# EAGLE design distribution_board (EAGLE 6.4)
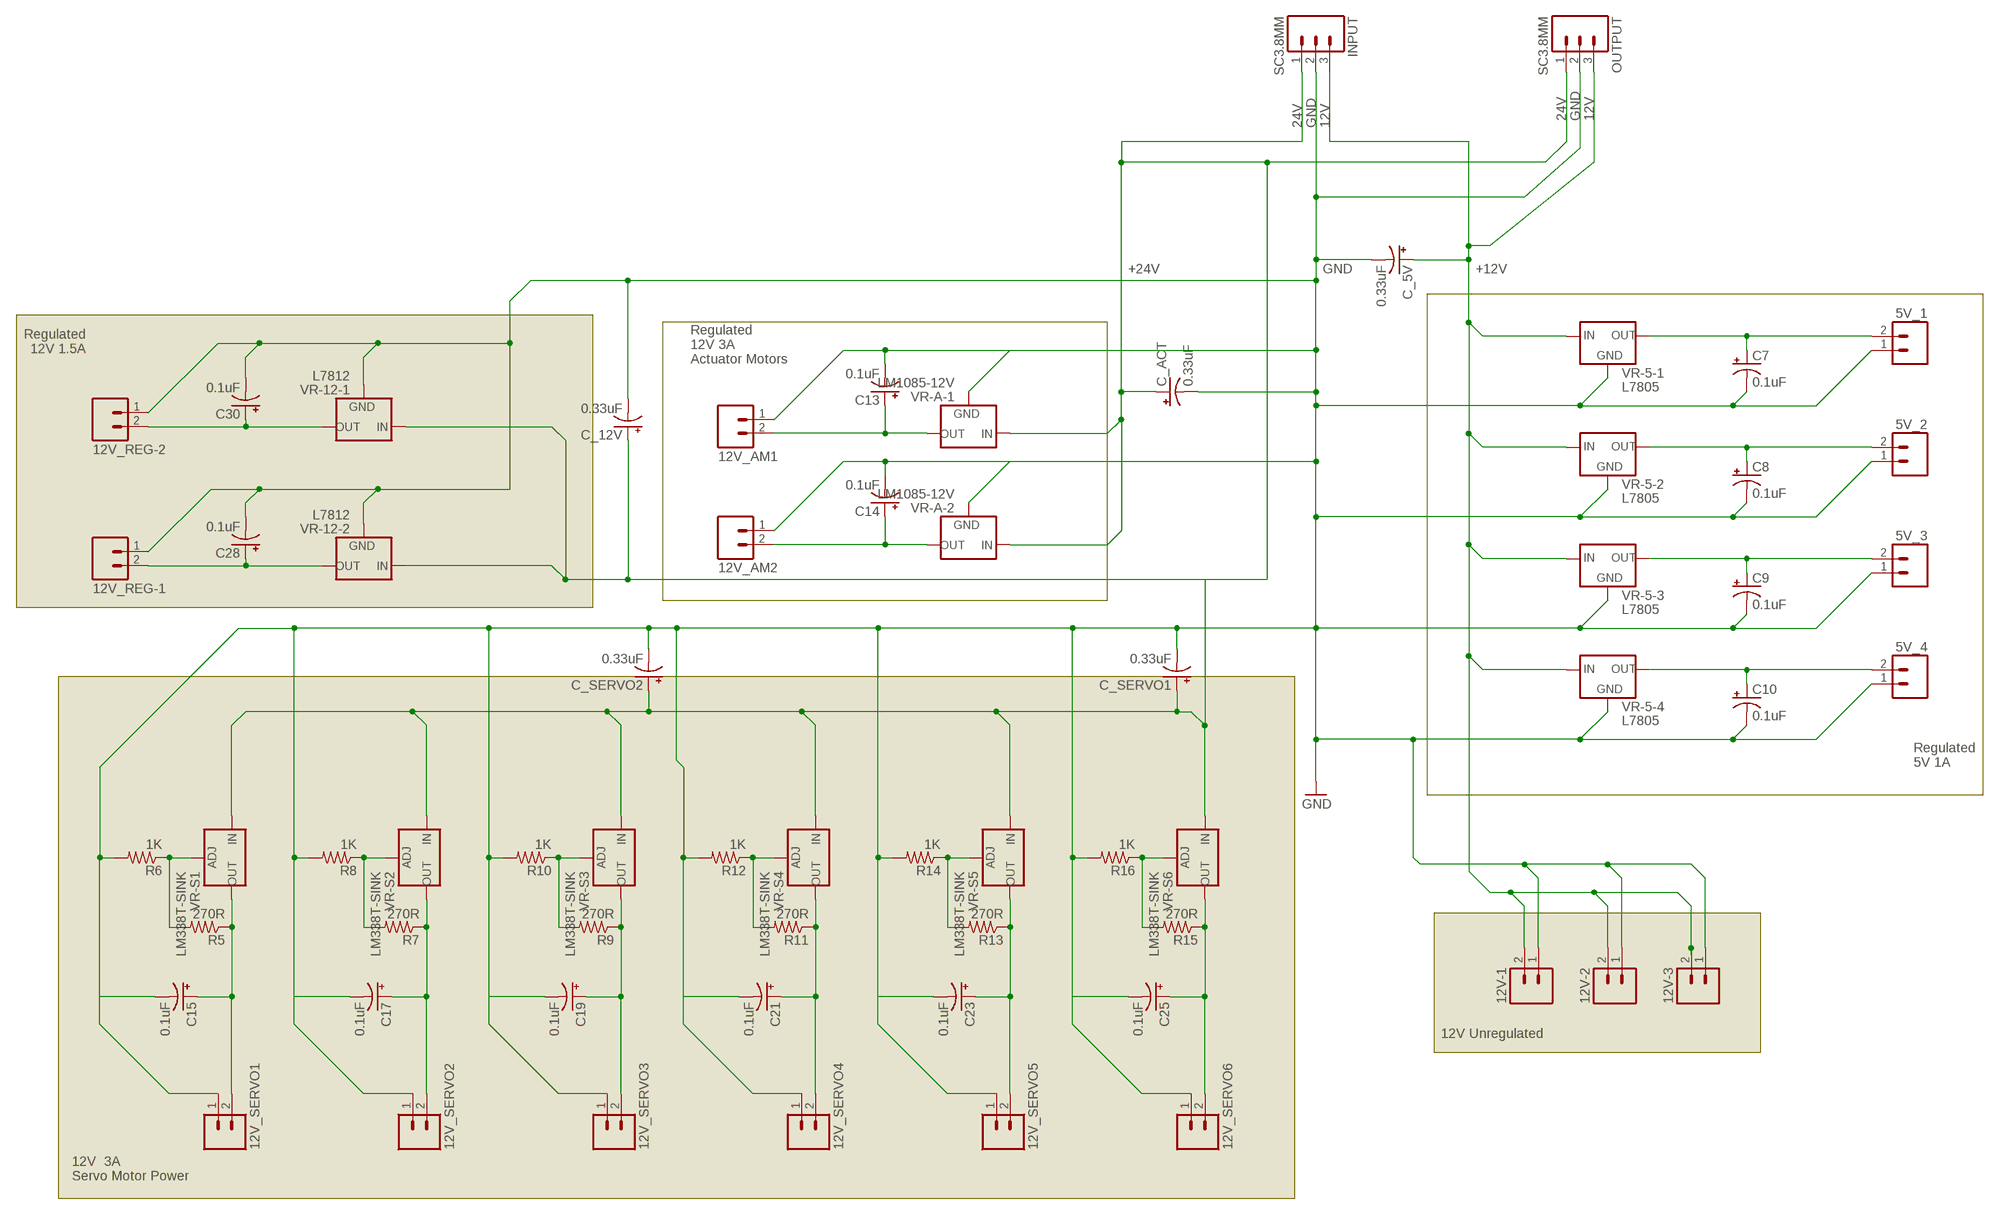
[diagram p0: schematic, sheet 1]

## Parts
5V_1  SC3.81MM  2-HOLESSC3.81MM  [SCREWTERMINAL-3.81MM]
5V_2  SC3.81MM  2-HOLESSC3.81MM  [SCREWTERMINAL-3.81MM]
5V_3  SC3.81MM  2-HOLESSC3.81MM  [SCREWTERMINAL-3.81MM]
5V_4  SC3.81MM  2-HOLESSC3.81MM  [SCREWTERMINAL-3.81MM]
12V-1  SC3.81MM  2-HOLESSC3.81MM  [SCREWTERMINAL-3.81MM]
12V-2  SC3.81MM  2-HOLESSC3.81MM  [SCREWTERMINAL-3.81MM]
12V-3  SC3.81MM  2-HOLESSC3.81MM  [SCREWTERMINAL-3.81MM]
12V_AM1  SC3.81MM  2-HOLESSC3.81MM  [SCREWTERMINAL-3.81MM]
12V_AM2  SC3.81MM  2-HOLESSC3.81MM  [SCREWTERMINAL-3.81MM]
12V_REG-1  SC3.81MM  2-HOLESSC3.81MM  [SCREWTERMINAL-3.81MM]
12V_REG-2  SC3.81MM  2-HOLESSC3.81MM  [SCREWTERMINAL-3.81MM]
12V_SERVO1  SC3.81MM  2-HOLESSC3.81MM  [SCREWTERMINAL-3.81MM]
12V_SERVO2  SC3.81MM  2-HOLESSC3.81MM  [SCREWTERMINAL-3.81MM]
12V_SERVO3  SC3.81MM  2-HOLESSC3.81MM  [SCREWTERMINAL-3.81MM]
12V_SERVO4  SC3.81MM  2-HOLESSC3.81MM  [SCREWTERMINAL-3.81MM]
12V_SERVO5  SC3.81MM  2-HOLESSC3.81MM  [SCREWTERMINAL-3.81MM]
12V_SERVO6  SC3.81MM  2-HOLESSC3.81MM  [SCREWTERMINAL-3.81MM]
C7  0.1uF  CAPACITOR_POL  [E2,5-5]
C8  0.1uF  CAPACITOR_POL  [E2,5-5]
C9  0.1uF  CAPACITOR_POL  [E2,5-5]
C10  0.1uF  CAPACITOR_POL  [E2,5-5]
C13  0.1uF  CAPACITOR_POL  [E2,5-5]
C14  0.1uF  CAPACITOR_POL  [E2,5-5]
C15  0.1uF  CAPACITOR_POL  [E2,5-5]
C17  0.1uF  CAPACITOR_POL  [E2,5-5]
C19  0.1uF  CAPACITOR_POL  [E2,5-5]
C21  0.1uF  CAPACITOR_POL  [E2,5-5]
C23  0.1uF  CAPACITOR_POL  [E2,5-5]
C25  0.1uF  CAPACITOR_POL  [E2,5-5]
C28  0.1uF  CAPACITOR_POL  [E2,5-5]
C30  0.1uF  CAPACITOR_POL  [E2,5-5]
C_5V  0.33uF  CAPACITOR_POL  [E2,5-5]
C_12V  0.33uF  CAPACITOR_POL  [E2,5-5]
C_ACT  0.33uF  CAPACITOR_POL  [E2,5-5]
C_SERVO1  0.33uF  CAPACITOR_POL  [E2,5-5]
C_SERVO2  0.33uF  CAPACITOR_POL  [E2,5-5]
INPUT  SC3.8MM  3-HOLES  [SCREWTERMINAL-5MM-3]
OUTPUT  SC3.8MM  3-HOLES  [SCREWTERMINAL-5MM-3]
R5  270R  RESISTOR0207/2V  [0207/2V]
R6  1K  RESISTOR0207/2V  [0207/2V]
R7  270R  RESISTOR0207/2V  [0207/2V]
R8  1K  RESISTOR0207/2V  [0207/2V]
R9  270R  RESISTOR0207/2V  [0207/2V]
R10  1K  RESISTOR0207/2V  [0207/2V]
R11  270R  RESISTOR0207/2V  [0207/2V]
R12  1K  RESISTOR0207/2V  [0207/2V]
R13  270R  RESISTOR0207/2V  [0207/2V]
R14  1K  RESISTOR0207/2V  [0207/2V]
R15  270R  RESISTOR0207/2V  [0207/2V]
R16  1K  RESISTOR0207/2V  [0207/2V]
VR-5-1  L7805  L7805ACD2T-TR  [TO263]
VR-5-2  L7805  L7805ACD2T-TR  [TO263]
VR-5-3  L7805  L7805ACD2T-TR  [TO263]
VR-5-4  L7805  L7805ACD2T-TR  [TO263]
VR-12-1  L7812  L7812CD2T-TRTO-263  [TO263]
VR-12-2  L7812  L7812CD2T-TRTO-263  [TO263]
VR-A-1  LM1085-12V  LM1085IT-SINK  [TO220V-HEATSINK]
VR-A-2  LM1085-12V  LM1085IT-SINK  [TO220V-HEATSINK]
VR-S1  LM338T-SINK  [TO220V-HEATSINK]
VR-S2  LM338T-SINK  [TO220V-HEATSINK]
VR-S3  LM338T-SINK  [TO220V-HEATSINK]
VR-S4  LM338T-SINK  [TO220V-HEATSINK]
VR-S5  LM338T-SINK  [TO220V-HEATSINK]
VR-S6  LM338T-SINK  [TO220V-HEATSINK]

## Nets
12V [power]: 12V-1.2 12V-2.2 12V-3.2 C_5V.+ INPUT.3 OUTPUT.3 VR-5-1.1(IN) VR-5-2.1(IN) VR-5-3.1(IN) VR-5-4.1(IN)
24V [power]: C_12V.+ C_ACT.+ C_SERVO1.+ C_SERVO2.+ INPUT.1 OUTPUT.1 VR-12-1.1(IN) VR-12-2.1(IN) VR-A-1.3(IN) VR-A-2.3(IN) VR-S1.3(IN) VR-S2.3(IN) VR-S3.3(IN) VR-S4.3(IN) VR-S5.3(IN) VR-S6.3(IN)
GND [ground]: 5V_1.1 5V_2.1 5V_3.1 5V_4.1 12V-1.1 12V-2.1 12V-3.1 12V_AM1.1 12V_AM2.1 12V_REG-1.1 12V_REG-2.1 12V_SERVO1.1 12V_SERVO2.1 12V_SERVO3.1 12V_SERVO4.1 12V_SERVO5.1 12V_SERVO6.1 C7.- C8.- C9.- C10.- C13.- C14.- C15.- C17.- C19.- C21.- C23.- C25.- C28.- C30.- C_5V.- C_12V.- C_ACT.- C_SERVO1.- C_SERVO2.- INPUT.2 OUTPUT.2 R6.2 R8.2 R10.2 R12.2 R14.2 R16.2 VR-5-1.3(GND) VR-5-2.3(GND) VR-5-3.3(GND) VR-5-4.3(GND) VR-12-1.3(GND) VR-12-2.3(GND) VR-A-1.1(GND) VR-A-2.1(GND)
N$3 [power]: 12V_REG-1.2 C28.+ VR-12-2.2(OUT)
N$7 [power]: 5V_1.2 C7.+ VR-5-1.2(OUT)
N$13 [power]: 5V_2.2 C8.+ VR-5-2.2(OUT)
N$14 [power]: 5V_3.2 C9.+ VR-5-3.2(OUT)
N$15 [power]: 5V_4.2 C10.+ VR-5-4.2(OUT)
N$17: 12V_AM1.2 C13.+ VR-A-1.2(OUT)
N$18 [power]: 12V_AM2.2 C14.+ VR-A-2.2(OUT)
N$19: R5.2 R6.1 VR-S1.1(ADJ)
N$21 [power]: 12V_REG-2.2 C30.+ VR-12-1.2(OUT)
N$23 [power]: 12V_SERVO1.2 C15.+ R5.1 VR-S1.2(OUT)
N$25 [power]: 12V_SERVO2.2 C17.+ R7.1 VR-S2.2(OUT)
N$26: R7.2 R8.1 VR-S2.1(ADJ)
N$28 [power]: 12V_SERVO3.2 C19.+ R9.1 VR-S3.2(OUT)
N$29: R9.2 R10.1 VR-S3.1(ADJ)
N$31 [power]: 12V_SERVO4.2 C21.+ R11.1 VR-S4.2(OUT)
N$32: R11.2 R12.1 VR-S4.1(ADJ)
N$34 [power]: 12V_SERVO5.2 C23.+ R13.1 VR-S5.2(OUT)
N$35: R13.2 R14.1 VR-S5.1(ADJ)
N$37 [power]: 12V_SERVO6.2 C25.+ R15.1 VR-S6.2(OUT)
N$38: R15.2 R16.1 VR-S6.1(ADJ)

## Notes on the sheet
- +24V | GND | +12V
- Regulated
  12V 1.5A
- Regulated
  12V 3A
  Actuator Motors
- Regulated
  5V 1A
- 12V Unregulated
- 12V  3A
  Servo Motor Power

## Library data of the parts
5V_1-5V_4 12V-1-12V-3 12V_AM1 12V_AM2 12V_REG-1 12V_REG-2 12V_SERVO1-12V_SERVO6 = parts:2-HOLES: TERMINAL 2-PIN Holes for connecting 2 pin terminal
C7-C10 C13-C15 C17 C19 C21 C23 C25 C28 C30 C_5V C_12V C_ACT C_SERVO1 C_SERVO2 = parts:CAPACITOR_POL: POLARIZED CAPACITOR, American symbol
INPUT OUTPUT = parts:3-HOLES: TERMINAL 3-PIN
R5-R16 = parts:RESISTOR: RESISTOR
VR-5-1-VR-5-4 = parts:L7805ACD2T-TR: VOLTAGE REGULATOR 5V 1A surface mount voltage regulator
VR-12-1 VR-12-2 = parts:L7812CD2T-TR: VOLTAGE REGULATOR 12V 1.5A voltage regulator
VR-A-1 VR-A-2 = parts:LM1085IT: VOLTAGE REGULATOR 12V 3A voltage regulator
VR-S1-VR-S6 = parts:LM338T: VOLTAGE REGULATOR Adjustable 1.2V to 32V 5A voltage regulator

## Net classes
1 ground: width 1.27 mm, clearance 0.762 mm
2 power: width 1.27 mm, clearance 0.762 mm

## Board
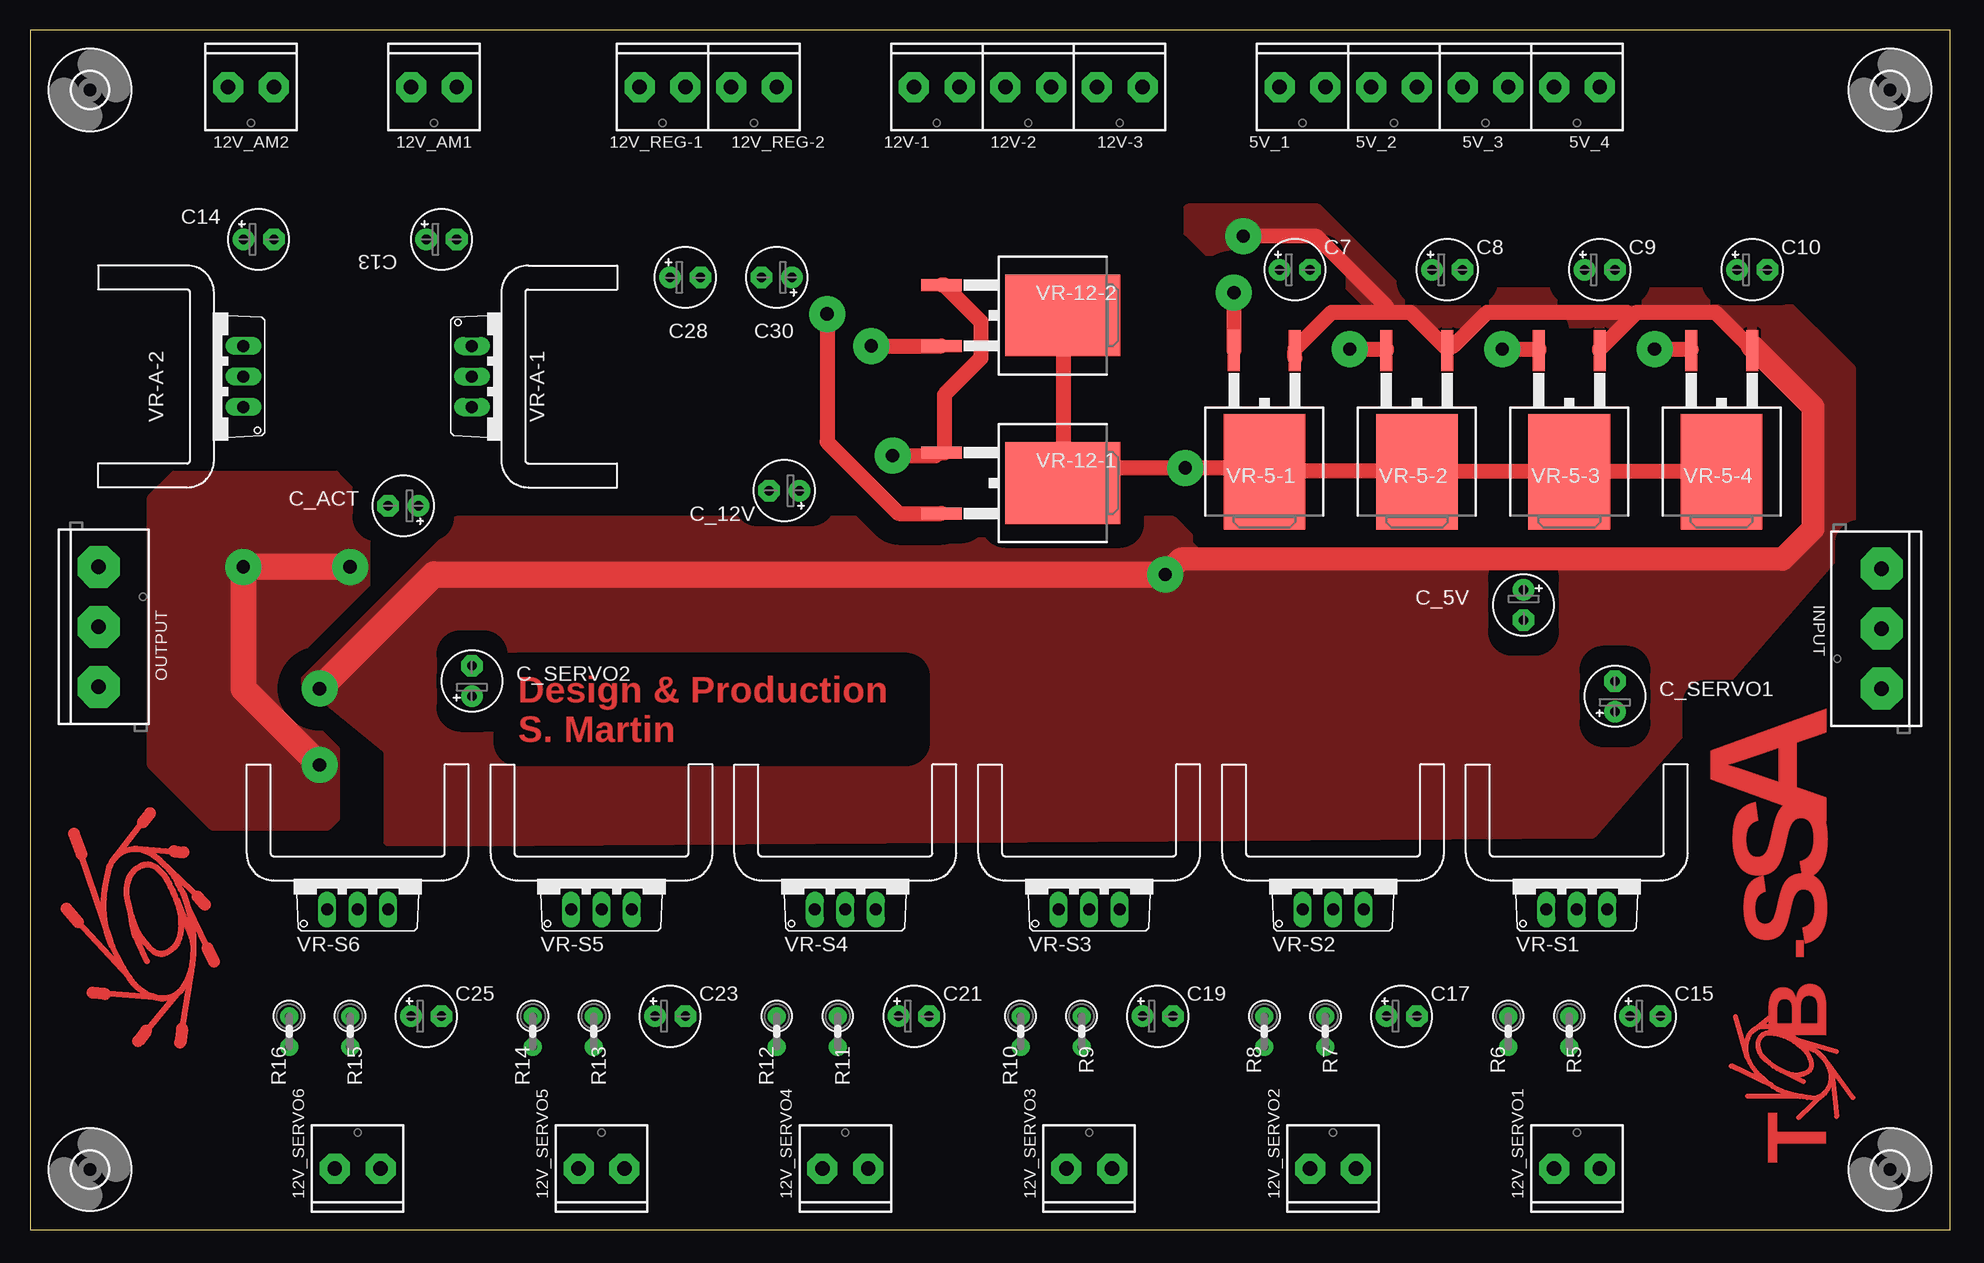
[diagram p1: board, top side]
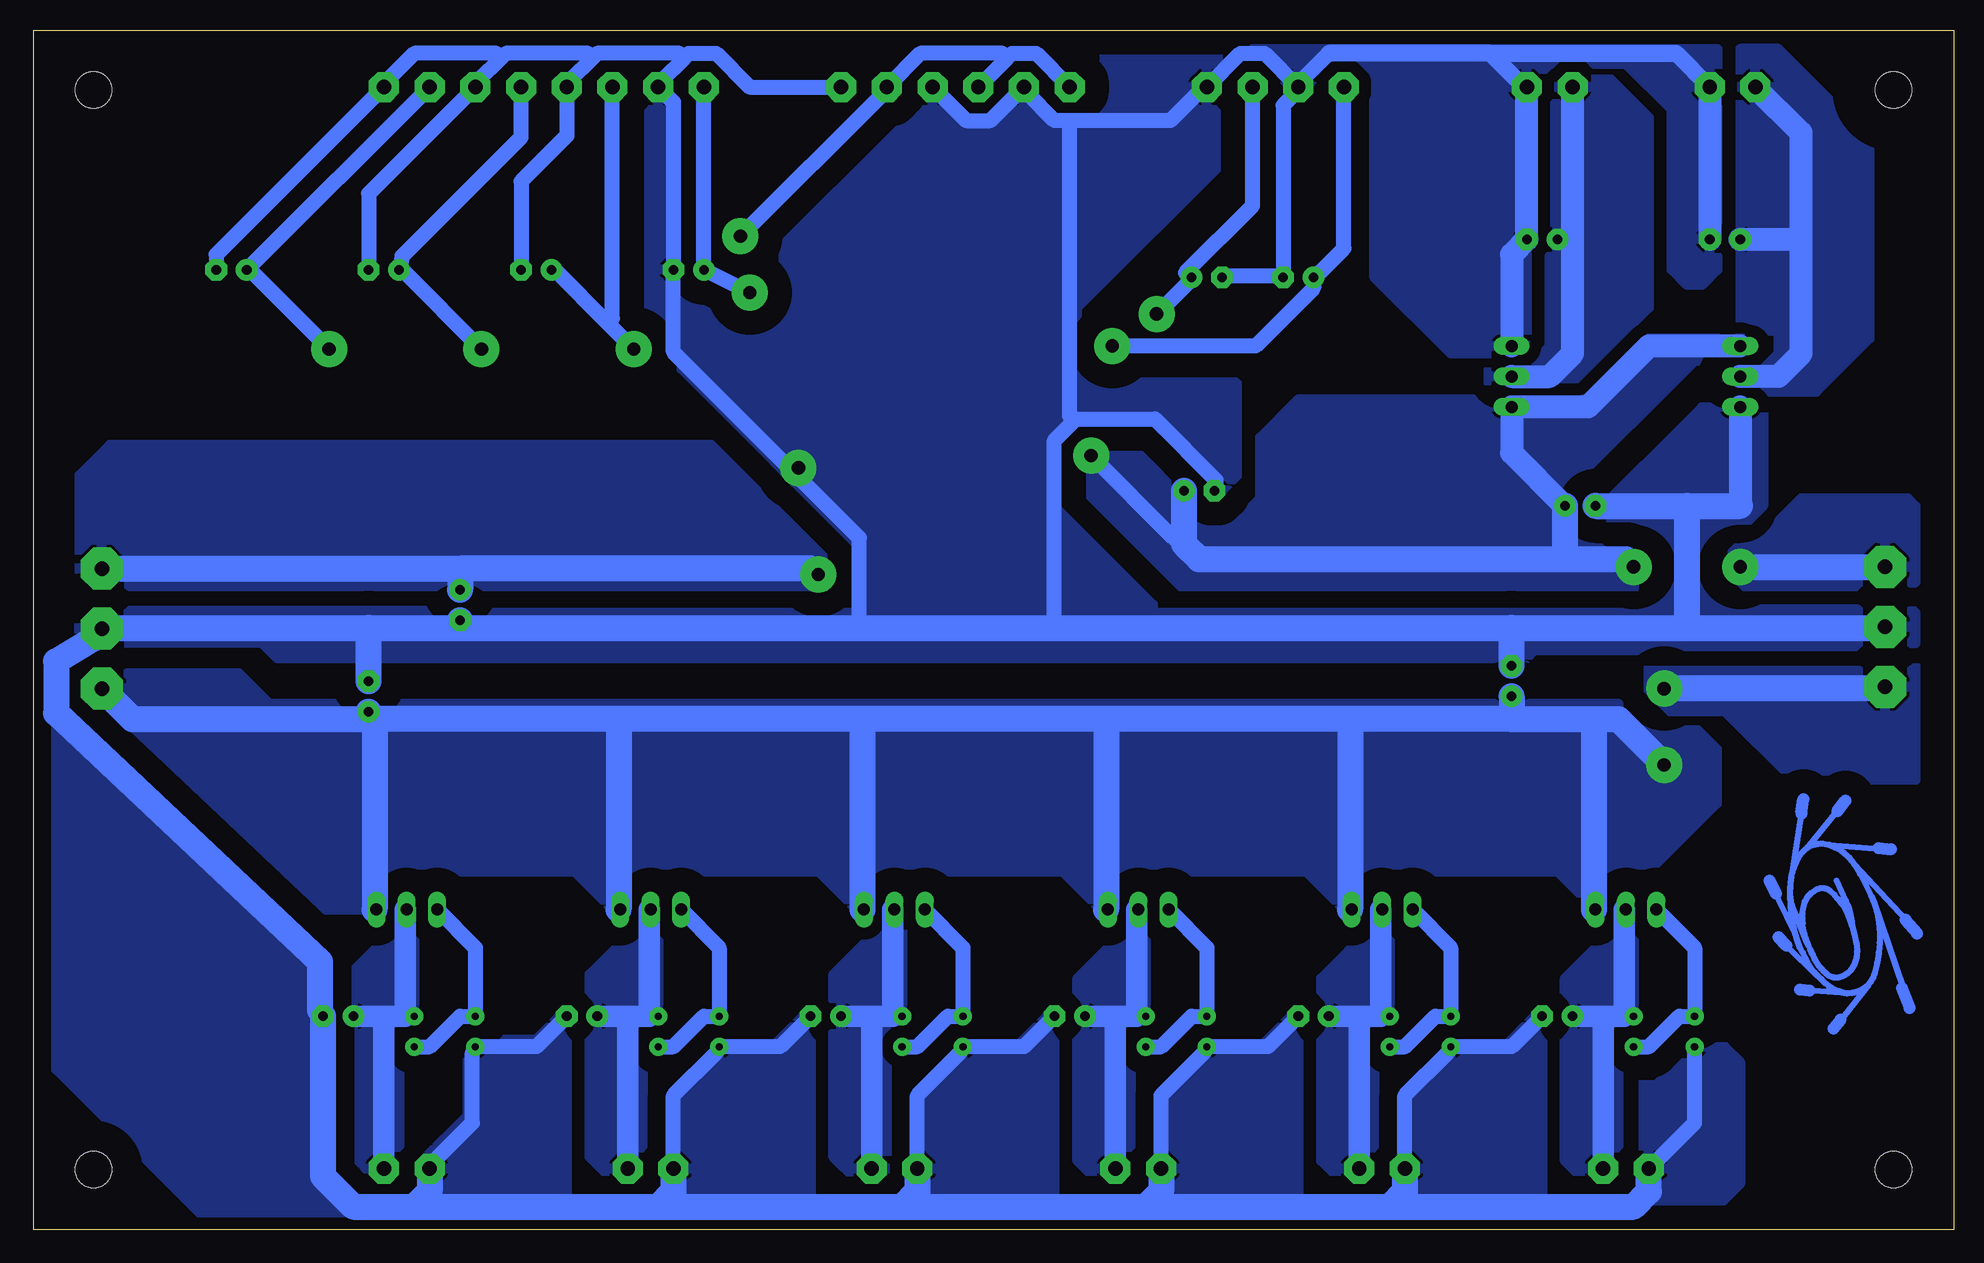
[diagram p2: board, bottom side, seen from below]

Size 160 x 100 mm. Coordinates in mm from the lower left corner, seen from the top.
Outline: 0,0 160,0 160,100 0,100 0,0
Copper layers (1*16): Top 0.035mm / dielectric 1.5mm / Bottom 0.035mm
Design rules "rules *": minimum track width 24mil, minimum drill 1.1mm, track to track 20mil, track to pad 20mil, pad to pad 30mil, via to via 50mil, smd to smd 8mil, copper to edge 40mil, drill to drill 8mil, minimum pad ring 10mil, minimum via ring 20mil, stop-mask expansion 4mil, vias tented up to drill 0mil, thermal gap 10mil
tRestrict: area 23.5,24.8 to 31.1,28.6; area 43.8,24.8 to 51.4,28.6; area 64.1,24.8 to 71.8,28.6; area 84.5,24.8 to 92.1,28.6; area 104.8,24.8 to 112.4,28.6; area 125.1,24.8 to 132.7,28.6; area 34.9,67.3 to 38.7,74.9; area 15.9,67.3 to 19.7,74.9

### Footprints (pad centres in the part's own frame; a part is rotated, then mirrored left to right if it is on the bottom)
SCREWTERMINAL-3.81MM = drill 1.2 pad 2.5 octagon: 1 0,0; 2 3.81,0
E2,5-5 = drill 0.8 pad 1.8: + -1.27,0 | drill 0.8 pad 1.8 octagon: - 1.27,0
SCREWTERMINAL-5MM-3 = drill 1.2 pad 3.5 octagon: 1 0,0; 2 5,0; 3 10,0
0207/2V = drill 0.6 pad 1.5: 1 -1.27,0; 2 1.27,0
3,0 = hole 3: 0,0
TO263 = smd 1 x 3.4: 1 -2.54,-6.6; 2 2.54,-6.6 | smd 6.8 x 9.6: 3 0,3.5
TO220V-HEATSINK = drill 1 long: 1 -2.54,-2.54; 2 0,-2.54; 3 2.54,-2.54

### Placement (x,y rotation side)
5V_1  107.95,95.25 180 top
5V_2  115.57,95.25 180 top
5V_3  123.19,95.25 180 top
5V_4  130.81,95.25 180 top
12V-1  77.47,95.25 180 top
12V-2  85.09,95.25 180 top
12V-3  92.71,95.25 180 top
12V_AM1  35.56,95.25 180 top
12V_AM2  20.32,95.25 180 top
12V_REG-1  54.61,95.25 180 top
12V_REG-2  62.23,95.25 180 top
12V_SERVO1  127,5.08 0 top
12V_SERVO2  106.68,5.08 0 top
12V_SERVO3  86.36,5.08 0 top
12V_SERVO4  66.04,5.08 0 top
12V_SERVO5  45.72,5.08 0 top
12V_SERVO6  25.4,5.08 0 top
C7  105.41,80.01 0 top
C8  118.11,80.01 0 top
C9  130.81,80.01 0 top
C10  143.51,80.01 0 top
C13  34.29,82.55 0 top
C14  19.05,82.55 0 top
C15  134.62,17.78 0 top
C17  114.3,17.78 0 top
C19  93.98,17.78 0 top
C21  73.66,17.78 0 top
C23  53.34,17.78 0 top
C25  33.02,17.78 0 top
C28  54.61,79.38 0 top
C30  62.23,79.38 180 top
C_5V  124.46,52.07 270 top
C_12V  62.87,61.59 180 top
C_ACT  31.11,60.33 180 top
C_SERVO1  132.08,44.45 90 top
C_SERVO2  36.83,45.72 90 top
INPUT  154.31,45.09 90 top
OUTPUT  5.71,55.24 270 top
R5  128.27,16.51 270 top
R6  123.19,16.51 270 top
R7  107.95,16.51 270 top
R8  102.87,16.51 270 top
R9  87.63,16.51 270 top
R10  82.55,16.51 270 top
R11  67.31,16.51 270 top
R12  62.23,16.51 270 top
R13  46.99,16.51 270 top
R14  41.91,16.51 270 top
R15  26.67,16.51 270 top
R16  21.59,16.51 270 top
U$2  [LOGO-SYNCHROTRON]  10.16,26.04 270 top
U$3  [LOGO-ASSBOT]  139.7,43.81 270 top
U$4  [LOGO-SYNCHROTRON]  10.16,25.4 90 bottom
U$5  [LOGO-ASSBOT-SILK]  81.28,41.27 0 top
U$6  [3,0]  5,95 0 top
U$7  [3,0]  155,95 0 top
U$8  [3,0]  5,5 0 top
U$9  [3,0]  155,5 0 top
VR-5-1  102.87,66.67 180 top
VR-5-2  115.57,66.67 180 top
VR-5-3  128.27,66.67 180 top
VR-5-4  140.97,66.67 180 top
VR-12-1  82.55,62.23 270 top
VR-12-2  82.55,76.2 270 top
VR-A-1  39.37,71.12 270 top
VR-A-2  15.24,71.12 90 top
VR-S1  128.91,29.21 0 top
VR-S2  108.58,29.21 0 top
VR-S3  88.27,29.21 0 top
VR-S4  67.94,29.21 0 top
VR-S5  47.62,29.21 0 top
VR-S6  27.3,29.21 0 top

### Tracks (layer width: path | path; a pad name or v marks a point on that pad's centre or on a via)
12V  (via drill 1.1 pad 3)
  Top 1.27: 113.03,76.45 115.06,76.45 118.11,73.41 | 113.03,76.45 108.46,76.45 105.41,73.41 VR-5-1.1 105.41,72.64 | 118.11,73.41 VR-5-2.1 | 133.48,76.07 133.86,76.45 140.46,76.45 143.51,73.41 | 133.48,76.07 130.81,73.41 VR-5-3.1 | 118.11,73.41 118.62,73.66 121.41,76.45 133.1,76.45 133.48,76.07 | v101.09,82.8 107.19,82.8 113.03,76.96 113.03,76.45 | 143.51,73.41 VR-5-4.1 | 143.51,73.41 143.64,73.53
  Top 1.93: v94.61,54.61 95.89,55.88 146.05,55.88 148.59,58.42 148.59,68.58 143.64,73.53 143.51,73.66
  Top 2.184: v24.13,45.09 33.66,54.61 v94.61,54.61
  Bottom 1.27: 12V-1.2 76.45,98.04 78.49,98.04 78.87,97.66 | 12V-2.2 78.87,97.66 | 78.87,97.66 79.25,98.04 86.11,98.04 12V-3.2 89.15,94.74 v101.09,82.8
  Bottom 2.184: INPUT.3 124.46,55.09 | 124.46,55.09 C_5V.+ | OUTPUT.3 5.88,45.09 v24.13,45.09 | v94.61,54.61 95.09,55.09 124.46,55.09
  pour Bottom (isolate 2): 156.21,56.52 156.21,53.34 93.98,53.34 93.98,55.88 100.33,62.23 103.5,65.41 153.67,65.41 156.21,62.87
  pour Bottom (isolate 2): 25.4,43.81 25.4,46.99 3.17,46.99 3.17,37.47 13.34,37.47 19.05,43.18 24.77,43.18
  pour Top (isolate 2): 35.56,59.05 35.56,58.42 22.86,45.72 29.84,40.01 29.84,32.38 41.91,32.38 130.18,33.02 151.76,57.78 151.76,71.75 145.41,78.11 114.3,78.11 107.31,85.09 96.52,85.09 96.52,83.19 98.42,81.28 107.31,81.28 113.03,75.56 140.97,75.56 148.59,67.94 148.59,59.05 144.78,55.24 99.69,55.24 99.06,54.61 96.52,57.15 96.52,57.78 95.25,59.05
24V  (via drill 1.1 pad 3)
  Top 1.27: VR-12-2.1 76.2,78.74 79.25,75.69 79.25,72.64 76.2,69.6 76.2,64.77 VR-12-1.1 75.44,64.52 v71.88,64.52
  Top 2.184: v26.67,55.24 v17.78,55.24 17.78,45.09 v24.13,38.73
  Bottom 1.27: 29.97,26.67 VR-S6.3 | 50.29,26.67 VR-S5.3 | 70.61,26.67 VR-S4.3 | 90.93,26.67 VR-S3.3 | 111.25,26.67 VR-S2.3 | 131.57,26.67 VR-S1.3 | v71.88,64.52 65.02,57.66 64.14,57.15
  Bottom 1.93: C_ACT.+ 36.83,64.77 VR-A-1.3 30.48,68.58 25.4,73.66 VR-A-2.3
  Bottom 2.184: INPUT.1 151.76,42.55 132.08,42.55 | 132.08,42.55 C_SERVO1.+ | C_SERVO2.+ 36.83,42.55 | 36.83,42.55 50.29,42.55 | 50.29,42.55 70.61,42.55 | 70.61,42.55 90.93,42.55 | 90.93,42.55 111.25,42.55 | 111.25,42.55 131.57,42.55 | 131.57,42.55 132.08,42.55 | 36.83,42.55 29.97,42.55 | 29.97,42.55 27.94,42.55 v24.13,38.73 | 32.38,55.88 27.3,55.88 v26.67,55.24 | C_ACT.+ 32.38,55.88 | C_12V.+ 64.14,57.15 62.87,55.88 32.38,55.88 | 29.97,42.55 29.97,26.67 | 50.29,42.55 50.29,26.67 | 70.61,42.55 70.61,26.67 | 90.93,42.55 90.93,26.67 | 111.25,42.55 111.25,26.67 | 131.57,42.55 131.57,26.67 | v17.78,55.24 OUTPUT.1
  pour Bottom (isolate 2): 21.59,41.91 26.04,41.91 arc90 27.94,43.81 140.34,43.81 142.88,46.35 154.31,46.35 154.31,43.81 137.16,26.67 132.08,26.67 132.08,27.3 129.54,29.84 114.94,29.84 111.76,26.67 108.58,29.84 94.61,29.84 91.44,26.67 88.27,29.84 74.3,29.84 71.12,26.67 70.48,26.67 67.31,29.84 53.98,29.84 50.8,26.67 47.62,29.84 33.02,29.84 29.84,26.67 29.84,27.3 27.94,29.21 26.04,29.21 19.68,35.56 19.68,40.01
  pour Bottom (isolate 2): 3.81,53.34 17.14,53.34 18.41,54.61 18.41,56.52 17.78,57.15 16.51,57.15 12.7,60.96 3.81,60.96 3.17,60.33 3.17,53.98
  pour Bottom (isolate 2): 26.67,53.34 64.14,53.34 72.39,61.59 72.39,64.77 66.67,64.77 64.14,62.23 64.14,60.33 62.23,58.42 60.33,58.42 57.78,60.96 57.78,66.04 54.61,69.22 30.48,69.22 25.4,74.3 17.14,74.3 17.14,73.03 17.78,72.39 21.59,72.39 32.38,61.59 32.38,59.69 29.84,57.15 arc-46 26.67,55.88
  pour Top (isolate 2): 25.4,40.01 25.4,34.29 24.77,33.66 15.24,33.66 10.16,38.73 10.16,60.96 12.06,62.87 25.4,62.87 27.94,60.33 27.94,53.34 20.95,46.35 20.95,44.45
GND  (via drill 1.1 pad 3)
  Top 1.27: VR-12-2.3 86.11,76.2 86.11,62.23 VR-12-1.3 86.61,63.5 v96.27,63.5 102.36,63.5 VR-5-1.3 102.87,63.25 115.57,63.25 VR-5-2.3 116.08,63.25 128.27,63.25 VR-5-3.3 128.78,63.25 140.97,63.25 VR-5-4.3
  Bottom 1.27: C19.- 97.79,15.24 R8.2 103.12,14.73 106.68,11.18 12V_SERVO2.1 | C17.- 118.11,15.24 R6.2 123.44,14.73 123.44,8.89 126.75,5.59 12V_SERVO1.1 | R16.2 21.59,8.89 12V_SERVO6.1 25.65,4.57 | C25.- 36.83,15.24 R14.2 42.16,14.73 45.72,11.18 12V_SERVO5.1 | C23.- 57.15,15.24 R12.2 62.48,14.73 66.04,11.18 12V_SERVO4.1 | C21.- 77.47,15.24 R10.2 82.8,14.73 86.36,11.18 12V_SERVO3.1 | C10.- 144.78,81.28 5V_4.1 130.56,95.76 128.27,98.04 121.41,98.04 121.03,97.66 | C9.- 132.08,86.36 5V_3.1 122.94,95.76 121.03,97.66 | C8.- 119.38,87.38 115.57,91.19 5V_2.1 115.32,95.76 113.41,97.66 | 12V-3.1 100.33,95.25 103.12,98.04 105.41,98.04 105.79,97.66 | 105.79,97.66 107.7,95.76 5V_1.1 106.68,93.98 C7.- 106.68,73.15 96.65,63.12 | 113.41,97.66 113.03,98.04 106.17,98.04 105.79,97.66 | 121.03,97.66 120.65,98.04 113.79,98.04 113.41,97.66 | 12V-2.1 82.3,92.46 80.26,92.46 12V-1.1 77.22,94.74 74.93,92.46 73.66,92.46 | C30.- 60.96,79.5 55.88,79.5 C28.- 55.88,93.73 54.86,94.74 12V_REG-1.1 | 12V_REG-1.1 57.4,98.04 59.44,98.04 12V_REG-2.1 62.74,95 65.28,92.46 73.66,92.46 | 73.28,67.44 74.93,65.79 74.93,50.16 | 73.28,67.44 73.15,67.56 66.55,67.56 61.47,62.48 61.47,61.72 C_12V.- | OUTPUT.2 5.84,50.29 5.84,50.16 | 52.07,98.04 54.36,95.76 12V_REG-1.1 | 36.07,95.5 12V_AM1.1 | 96.65,63.12 91.19,57.66 91.19,50.16 | v96.27,63.5 96.65,63.12 | 136.14,18.29 C15.- | 154.94,49.28 INPUT.2 | 73.66,92.46 73.66,67.82 73.28,67.44
  Bottom 1.422: 38.61,98.04 52.07,98.04 | 36.07,95.5 38.61,98.04 | 38.61,98.04 23.11,98.04 12V_AM2.1
  Bottom 1.93: 12V_AM1.1 C13.- 36.83,81.28 VR-A-1.1 | 12V_AM2.1 C14.- | VR-A-2.1 17.78,60.33
  Bottom 2.184: INPUT.2 154.22,50.16 132.08,50.16 | 125.09,50.16 91.19,50.16 74.93,50.16 36.83,50.16 | 36.83,50.16 22.23,50.16 | 22.23,50.16 5.84,50.16 5.71,50.16 | C_SERVO1.- 132.08,50.16 | 132.08,50.16 125.09,50.16 | 125.09,50.16 arc-90 C_5V.- | C_SERVO2.- 36.83,50.16 | C_ACT.- 22.23,60.33 | 22.23,60.33 17.78,60.33 | 136.14,18.29 136.14,22.35 158.12,43.05 158.12,47.37 154.94,49.28 | C15.- 135.89,4.45 133.35,1.91 128.27,1.91 | 128.27,1.91 107.95,1.91 | 107.95,1.91 87.63,1.91 | 87.63,1.91 67.31,1.91 | 67.31,1.91 46.99,1.91 | 46.99,1.91 26.67,1.91 25.4,3.17 12V_SERVO6.1 | 12V_SERVO5.1 45.72,3.17 46.99,1.91 | 12V_SERVO4.1 66.04,3.17 67.31,1.91 | 12V_SERVO3.1 86.36,3.17 87.63,1.91 | 12V_SERVO2.1 106.68,3.17 107.95,1.91 | 12V_SERVO1.1 127,3.17 128.27,1.91 | 22.23,60.33 22.23,50.16
  pour Bottom (isolate 2): 139.7,47.62 140.97,48.9 156.21,48.9 156.21,52.07 126.36,52.07 124.46,50.16 123.83,50.16 122.56,51.44 26.04,51.44 24.77,52.7 24.77,57.15 26.04,58.42 29.84,58.42 30.48,59.05 20.95,68.58 15.88,68.58 15.88,60.33 19.68,56.52 19.68,52.7 4.45,52.7 3.17,51.44 3.17,48.9 3.81,48.26 34.92,48.26 35.56,47.62
  pour Bottom: 132.72,1.27 146.05,1.27 158.12,13.34 158.12,42.55 158.75,43.18 158.12,43.18 135.89,20.95 135.89,4.45
  pour Bottom (isolate 2): 66.67,50.8 66.67,52.07 74.93,60.33 74.93,66.04 73.03,67.94 67.31,67.94 66.04,66.67 65.41,66.67 61.59,62.87 61.59,62.23 60.96,61.59 59.69,62.87 59.69,66.04 59.69,70.48 60.33,71.12 72.39,71.12 73.03,71.75 73.03,76.83 60.33,89.53 60.33,95.25 59.69,95.89 59.69,97.79 60.33,98.42 71.75,98.42 71.75,92.71 72.39,92.08 74.3,92.08 76.2,93.98 77.47,93.98 86.36,93.98 97.79,82.55 97.79,78.74 97.79,74.93 101.6,74.93 106.68,80.01 106.68,93.98 107.95,95.25 109.86,95.25 109.86,76.2 106.05,72.39 106.05,71.75 90.81,56.52 90.81,51.44 91.44,50.8 67.31,50.8 66.67,50.16
  pour Bottom (isolate 1): 19.68,98.42 19.68,80.01 20.95,78.74 22.23,78.74 23.5,80.01 23.5,93.34 27.3,97.16 33.66,97.16 35.56,95.25 35.56,74.3 36.83,73.03 41.91,73.03 48.26,79.38 48.26,95.89 49.53,97.16 52.07,97.16 53.98,95.25 55.24,95.25 58.42,98.42
  pour Bottom (isolate 1): 133.35,1.27 133.35,2.54 128.91,2.54 111.76,2.54 91.44,2.54 71.75,2.54 67.31,2.54 51.44,2.54 27.3,2.54
  pour Bottom (isolate 2): 45.72,2.54 45.72,11.43 41.91,15.24 37.47,15.24 34.92,17.78 34.29,17.14 34.29,1.91 45.72,1.91
  pour Bottom (isolate 2): 66.04,2.54 66.04,11.43 62.23,15.24 57.78,15.24 55.24,17.78 54.61,17.14 54.61,1.91 66.04,1.91
  pour Bottom (isolate 2): 86.36,2.54 86.36,11.43 82.55,15.24 78.11,15.24 75.56,17.78 74.93,17.14 74.93,1.91 86.36,1.91
  pour Bottom (isolate 2): 106.68,2.54 106.68,11.43 102.87,15.24 98.42,15.24 95.89,17.78 95.25,17.14 95.25,1.91 106.68,1.91
  pour Bottom (isolate 2): 127.64,1.91 127.64,5.71 123.83,9.53 123.83,15.24 123.19,15.88 118.11,15.88 115.57,18.41 115.57,1.91
  pour Bottom (isolate 2): 26.04,1.91 26.04,12.06 24.77,12.06 21.59,15.24 19.05,15.24 17.78,13.97 17.78,3.81 20.32,1.27 26.04,1.27
N$3  (via drill 1.1 pad 3)
  Top 1.27: v70.1,73.66 VR-12-2.2
  Bottom 1.27: v70.1,73.66 58.17,73.66 53.34,78.49 C28.+ 52.83,79.76 50.8,81.79 12V_REG-1.2
N$7  (via drill 1.1 pad 3)
  Top 1.27: v100.33,78.11 VR-5-1.2
  Bottom 1.27: v100.33,78.11 C7.+ 5V_1.2
N$13  (via drill 1.1 pad 3)
  Top 1.27: v109.98,73.41 113.03,73.41 VR-5-2.2
  Bottom 1.27: 112.14,75.56 116.59,80.01 C8.+ | 112.14,75.56 v109.98,73.41 | 5V_2.2 111.76,75.95 112.14,75.56
N$14  (via drill 1.1 pad 3)
  Top 1.27: v122.68,73.41 125.73,73.41 VR-5-3.2
  Bottom 1.27: v122.68,73.41 129.29,80.01 C9.+ 129.29,81.15 119.38,91.06 5V_3.2
N$15  (via drill 1.1 pad 3)
  Top 1.27: v135.38,73.41 138.43,73.41 VR-5-4.2
  Bottom 1.27: v135.38,73.41 141.99,80.01 C10.+ 5V_4.2
N$17
  Bottom 1.676: C13.+ 31.75,82.55
  Bottom 1.93: 12V_AM1.2 31.75,82.55 31.75,73.03 33.66,71.12 VR-A-1.2
  pour Bottom (isolate 1): 38.73,70.48 38.73,71.75 38.1,72.39 34.29,72.39 34.29,73.03 33.66,73.66 33.66,95.25 32.38,96.52 29.21,96.52 25.4,92.71 25.4,76.83 31.75,70.48
N$18
  Bottom 1.93: VR-A-2.2 14.61,71.12 12.7,73.03 12.7,82.55 | 12.7,82.55 12.7,91.44 12V_AM2.2 | C14.+ 12.7,82.55
  pour Bottom (isolate 1): 19.68,69.85 11.43,69.85 6.99,74.3 6.99,90.81 14.61,98.42 17.78,98.42 17.78,74.93 14.61,74.93 14.61,73.66 14.61,73.03 16.51,71.12 18.41,71.12
N$19
  Bottom 1.27: R5.2 127,15.24 124.46,17.78 R6.1 123.19,23.5 VR-S1.1
N$21  (via drill 1.1 pad 3)
  Top 1.27: VR-12-1.2 72.39,59.69 66.42,65.66 v66.42,76.33
  Bottom 1.27: v66.42,76.33 63.5,79.25 C30.+ 64.01,79.76 58.42,85.34 12V_REG-2.2
N$23
  Bottom 1.27: 129.03,17.78 R5.1 | 129.03,26.67 VR-S1.2
  Bottom 1.778: C15.+ 130.81,17.78 | 130.81,17.78 129.03,17.78 129.03,26.67 | 130.81,17.78 12V_SERVO1.2
  pour Bottom (isolate 1.5): 128.27,27.3 128.27,17.14 129.54,15.88 129.54,3.81 132.08,3.81 133.99,5.71 133.99,20.95 129.54,25.4 129.54,26.04
N$25
  Bottom 1.27: 108.71,17.78 R7.1 | 108.71,26.67 VR-S2.2
  Bottom 1.778: C17.+ 110.49,17.78 | 110.49,17.78 108.71,17.78 108.71,26.67 | 110.49,17.78 12V_SERVO2.2
  pour Bottom (isolate 1.5): 107.95,27.62 107.95,17.46 109.22,16.19 109.22,4.13 111.76,4.13 113.67,6.03 113.67,21.27 109.22,25.72 109.22,26.35
N$26
  Bottom 1.27: VR-S2.1 102.87,23.5 R8.1 104.14,17.78 106.68,15.24 R7.2
N$28
  Bottom 1.27: 88.39,17.78 R9.1 | 88.39,26.67 VR-S3.2
  Bottom 1.778: C19.+ 90.17,17.78 | 90.17,17.78 88.39,17.78 88.39,26.67 | 90.17,17.78 12V_SERVO3.2
  pour Bottom (isolate 1): 87.63,27.62 87.63,17.46 88.9,16.19 88.9,4.13 91.44,4.13 93.34,6.03 93.34,21.27 88.9,25.72 88.9,26.35
N$29
  Bottom 1.27: VR-S3.1 82.55,23.5 R10.1 83.82,17.78 86.36,15.24 R9.2
N$31
  Bottom 1.27: 68.07,17.78 R11.1 | 68.07,26.67 VR-S4.2
  Bottom 1.778: C21.+ 69.85,17.78 | 69.85,17.78 68.07,17.78 68.07,26.67 | 69.85,17.78 12V_SERVO4.2
  pour Bottom (isolate 1.5): 67.31,27.3 67.31,17.14 68.58,15.88 68.58,3.81 71.12,3.81 73.03,5.71 73.03,20.95 68.58,25.4 68.58,26.04
N$32
  Bottom 1.27: VR-S4.1 62.23,23.5 R12.1 63.5,17.78 66.04,15.24 R11.2
N$34
  Bottom 1.27: 47.75,17.78 R13.1 | 47.75,26.67 VR-S5.2
  Bottom 1.778: C23.+ 49.53,17.78 | 49.53,17.78 47.75,17.78 47.75,26.67 | 49.53,17.78 12V_SERVO5.2
  pour Bottom (isolate 1.5): 46.99,27.3 46.99,17.14 48.26,15.88 48.26,3.81 50.8,3.81 52.7,5.71 52.7,20.95 48.26,25.4 48.26,26.04
N$35
  Bottom 1.27: VR-S5.1 41.91,23.5 R14.1 43.18,17.78 45.72,15.24 R13.2
N$37
  Bottom 1.27: 27.43,17.78 R15.1 | 27.43,26.67 VR-S6.2
  Bottom 1.778: C25.+ 29.21,17.78 | 29.21,17.78 27.43,17.78 27.43,26.67 | 29.21,17.78 12V_SERVO6.2
  pour Bottom (isolate 1.5): 26.67,27.3 26.67,17.14 27.94,15.88 27.94,3.81 30.48,3.81 32.38,5.71 32.38,20.95 27.94,25.4 27.94,26.04
N$38
  Bottom 1.27: VR-S6.1 21.59,23.5 R16.1 22.86,17.78 25.4,15.24 R15.2

### Text on the board
Top: Design & Production / S. Martin
_tplace: ACT. M2 | ACT. M1 | 12V RAW | 12V REG | 5V REG | 12V | GND | 12V | GND | 12V | GND | 12V | GND | 12V | GND | 12V | GND | 12V | GND | 5V | GND | 5V | GND | 5V | GND | 5V | GND | Vin | 24V | 12V | POWER DISTRIBUTION / BOARD | GND | GND | 12V | 24V | Vout | GND | 6V | GND | 6V | GND | 6V | GND | 6V | GND | 6V | GND | 6V | SERVO 6 | SERVO 5 | SERVO 4 | SERVO 3 | SERVO 2 | SERVO 1